# Altium schematic sheet [04] ADC.SchDoc: Design 1
size Tabloid; Engineer: The ASID Designer; Organization: ASID Designer; Address1: Iran; Address2: Shiraz; Address3: P.O.Box 71765-385; DocumentNumber: 1; Revision: 1.0; SheetNumber: 1; SheetTotal: 1
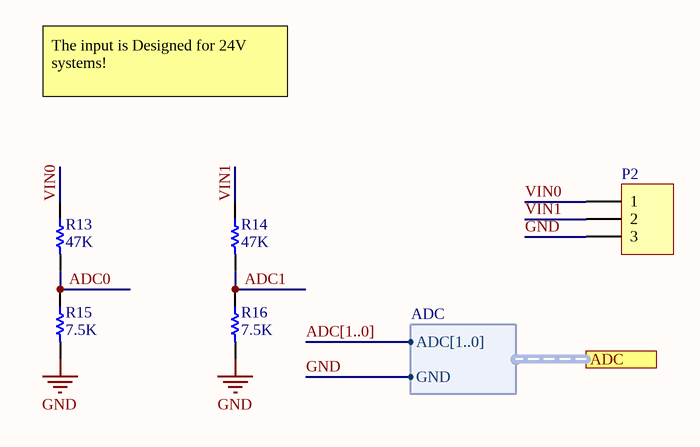
[diagram p0: [04] ADC.SchDoc]

## Parts
P2  Header 3  [MY_ECH381H_03P]  (value not drawn)
R13  47K  [MY_0805]
R14  47K  [MY_0805]
R15  7.5K  [MY_0805]
R16  7.5K  [MY_0805]

## Ports
ADC (harness ADC)

## Harnesses
ADC: ADC[1..0], GND

## Nets
GND: P2.3 R15.2 R16.2 ; port ADC.GND
ADC0: R13.2 R15.1
ADC1: R14.2 R16.1
VIN0: P2.1 R13.1
VIN1: P2.2 R14.1

## Buses and harness runs
bus ADC[1..0]

## Notes on the sheet
- The input is Designed for 24V systems!
- Title
- Engineer:
- Date:
- Ali Asadzadeh
- Time:
- Number:
- Sheet
- Revision:
- of
- www.ASiDesigner.com
- Designed In Shiraz
- ASiD Designer
- File:

## Library data of the parts
P2 = Header 3: Header, 3-Pin; ASiD Part Number: Header 3-AS
R13-R16 = Res: Standard resistor; ASiD Part Number: Res-AS
  R13 R14: Value: 47K
  R15 R16: Value: 7.5K